# Altium project STM32F407_CORE.PrjPcb
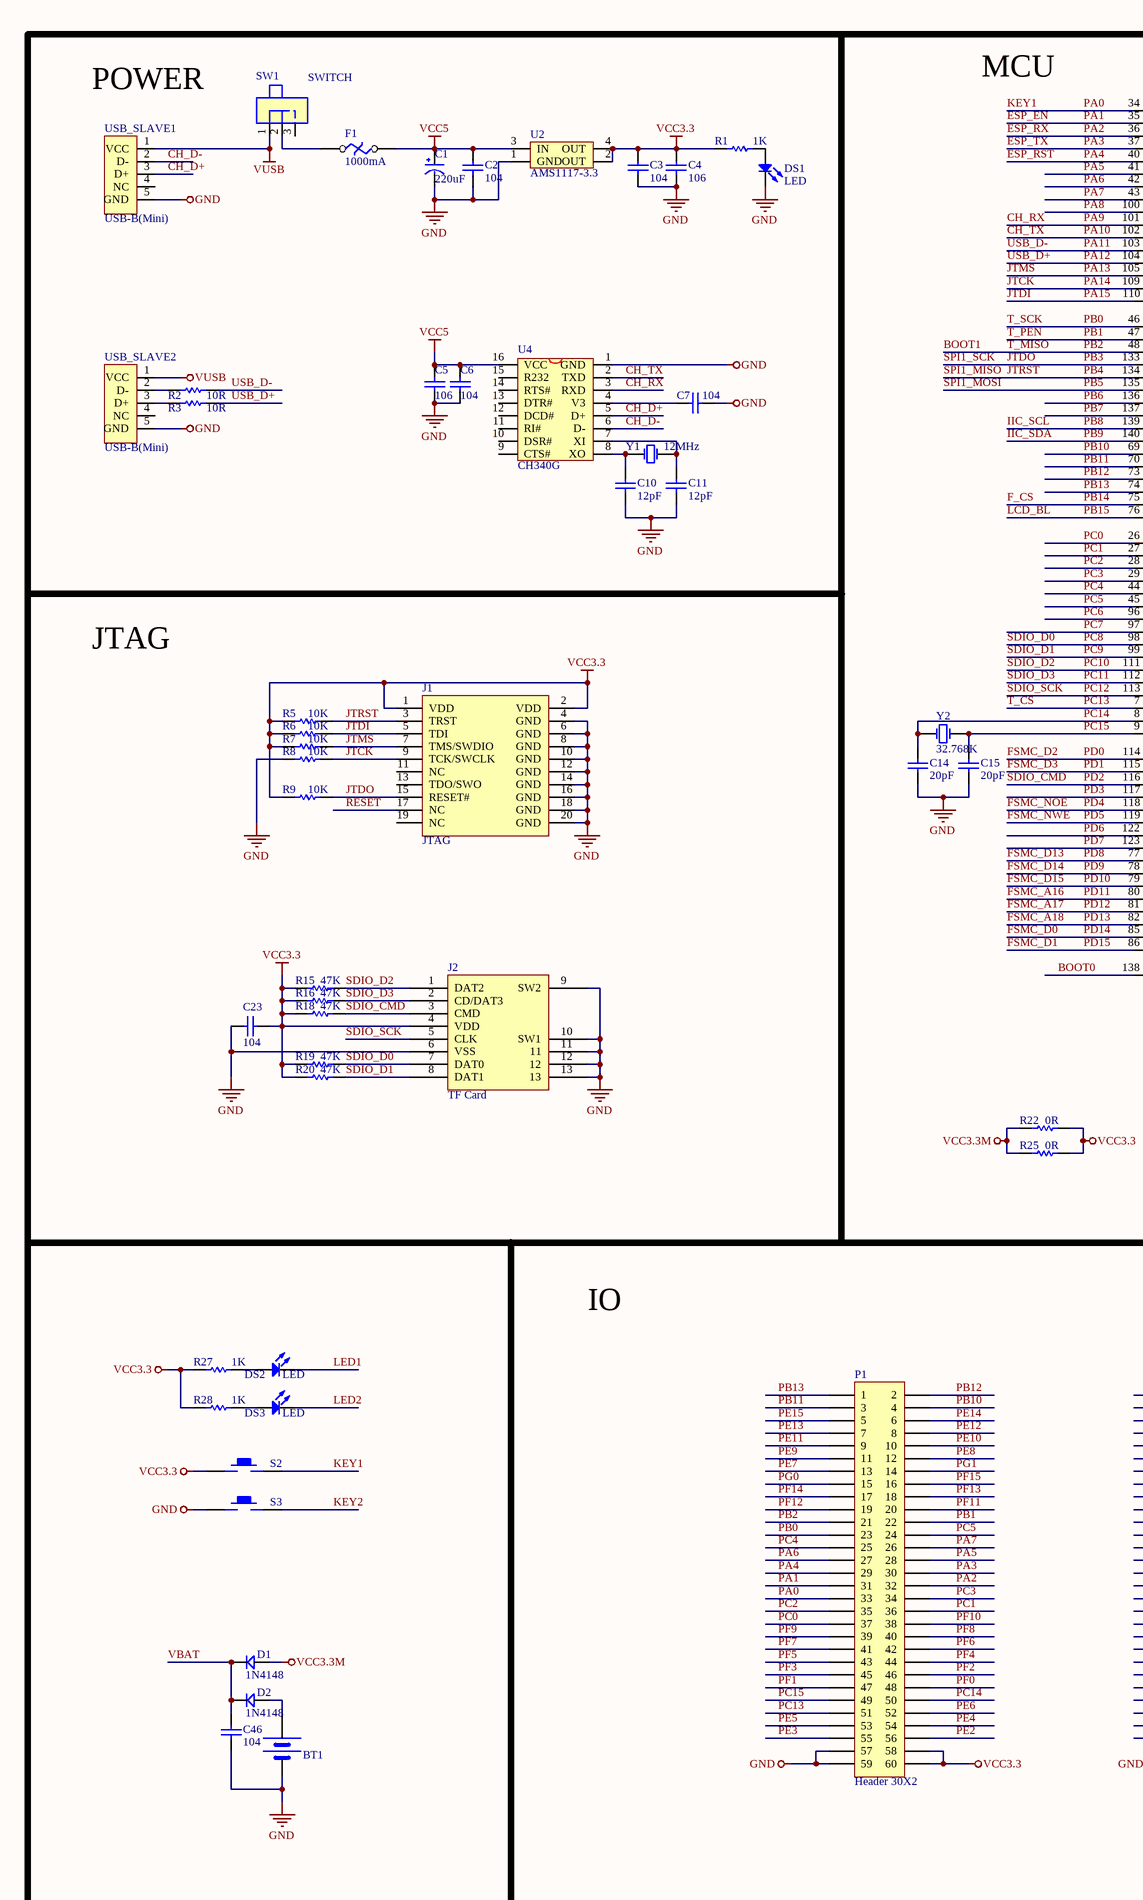
[diagram p0: STM32F407_CORE.SchDoc, left]
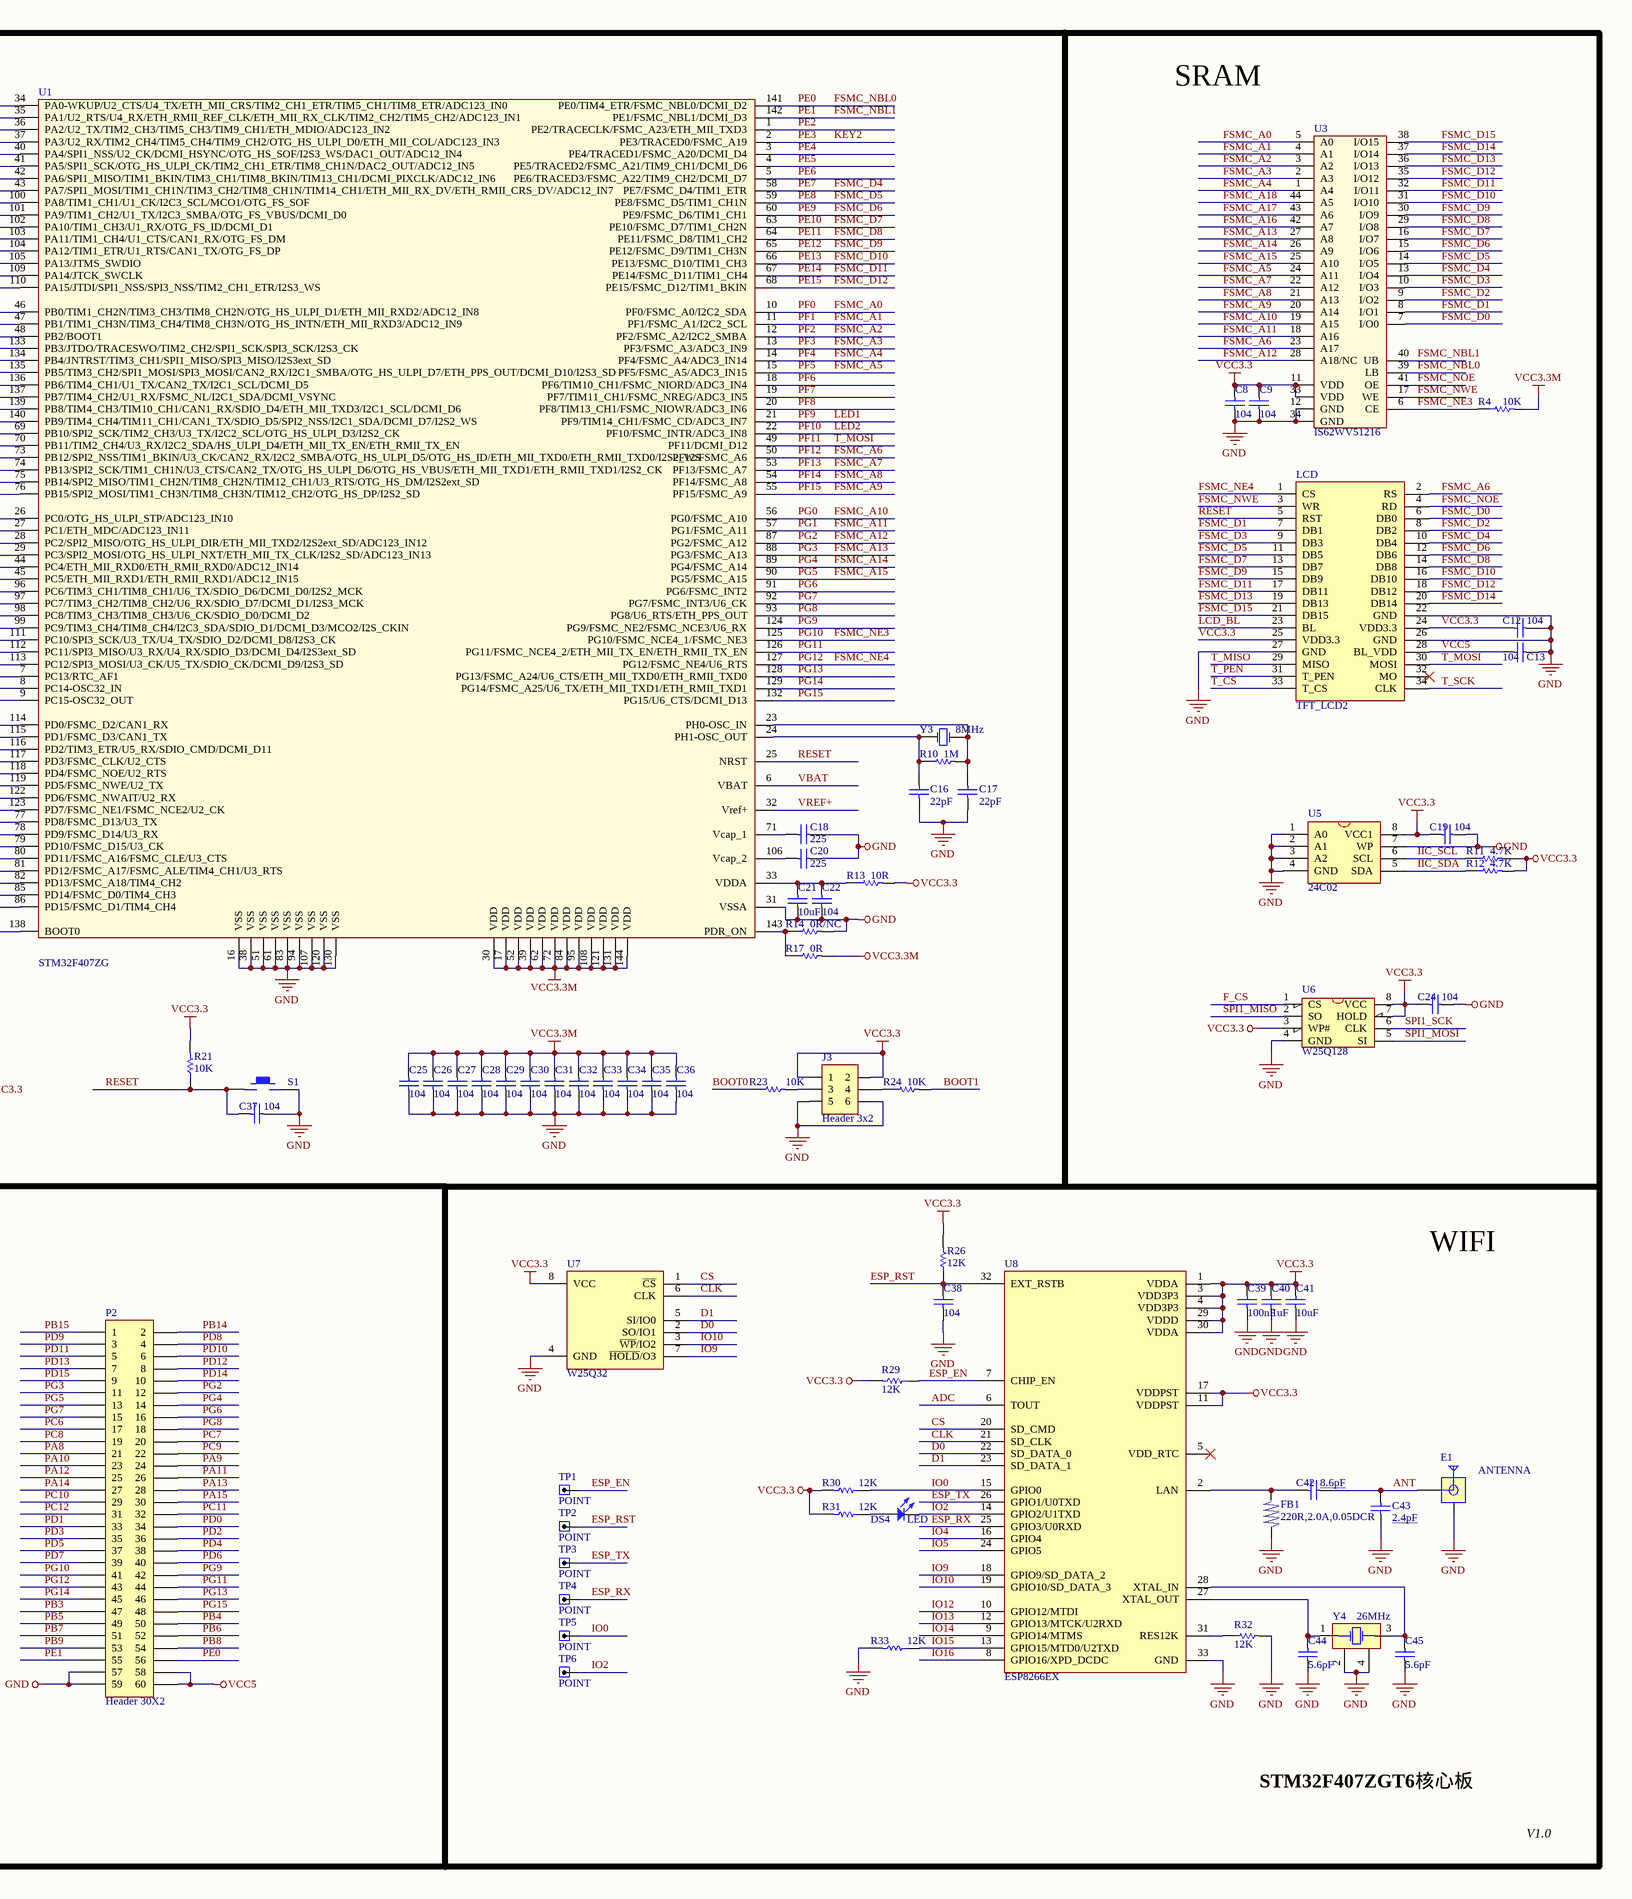
[diagram p1: STM32F407_CORE.SchDoc, right]
1 sheet, 119 parts. Net scope: global (net labels, ports and power ports of the same name join across sheets).
Board file: STM32F407_CORE.PcbDoc

## Sheet STM32F407_CORE.SchDoc
size A2

### Parts
BT1  BATTERY  [SBAT-1220]  (value not drawn)
C1  220uF  [TAJ-B]
C2  104  [C0603]
C3  104  [C0603]
C4  106  [C0603]
C5  106  [C0603]
C6  104  [C0603]
C7  104  [C0603]
C8  104  [C0603]
C9  104  [C0603]
C10  12pF  [C0603]
C11  12pF  [C0603]
C12  104  [C0603]
C13  104  [C0603]
C14  20pF  [C0603]
C15  20pF  [C0603]
C16  22pF  [C0603]
C17  22pF  [C0603]
C18  225  [C0603]
C19  104  [C0603]
C20  225  [C0603]
C21  10uF  [C0603]
C22  104  [C0603]
C23  104  [C0603]
C24  104  [C0603]
C25  104  [C0603]
C26  104  [C0603]
C27  104  [C0603]
C28  104  [C0603]
C29  104  [C0603]
C30  104  [C0603]
C31  104  [C0603]
C32  104  [C0603]
C33  104  [C0603]
C34  104  [C0603]
C35  104  [C0603]
C36  104  [C0603]
C37  104  [C0603]
C38  104  [C0603]
C39  100nF  [C0603]
C40  1uF  [C0603]
C41  10uF  [C0603]
C42  8.6pF  [C0603]
C43  2.4pF  [C0603]
C44  5.6pF  [C0603]
C45  5.6pF  [C0603]
C46  104  [C0603]
D1  1N4148  [D1206]
D2  1N4148  [D1206]
DS1  LED  [LED0603]
DS2  LED  [LED0603]
DS3  LED  [LED0603]
DS4  LED  [LED0603]
E1  ANTENNA  [ANT2.4G]
F1  1000mA  [F0805]
FB1  220R,2.0A,0.05DCR  [L0805]
J1  JTAG  [DC3-20P-W]
J2  TF Card  [TF-Card]
J3  Header 3x2  [HDR2X3]
LCD  TFT_LCD2  [TFT-HDR2X17]
P1  Header 30X2  [HDR2X30]
P2  Header 30X2  [HDR2X30]
R1  1K  [R0603]
R2  10R  [R0603]
R3  10R  [R0603]
R4  10K  [R0603]
R5  10K  [R0603]
R6  10K  [R0603]
R7  10K  [R0603]
R8  10K  [R0603]
R9  10K  [R0603]
R10  1M  [R0603]
R11  4.7K  [R0603]
R12  4.7K  [R0603]
R13  10R  [R0603]
R14  0R/NC  [R0603]
R15  47K  [R0603]
R16  47K  [R0603]
R17  0R  [R0603]
R18  47K  [R0603]
R19  47K  [R0603]
R20  47K  [R0603]
R21  10K  [R0603]
R22  0R  [R0603]
R23  10K  [R0603]
R24  10K  [R0603]
R25  0R  [R0603]
R26  12K  [R0603]
R27  1K  [R0603]
R28  1K  [R0603]
R29  12K  [R0603]
R30  12K  [R0603]
R31  12K  [R0603]
R32  12K  [R0603]
R33  12K  [R0603]
S1  KEY  [DSW-KFC-022S-H2.5]  (value not drawn)
S2  KEY  [DSW-KEY-SOT-4_5x4_5]  (value not drawn)
S3  KEY  [DSW-KEY-SOT-4_5x4_5]  (value not drawn)
SW1  SWITCH  [SW-SS12D07VG4]
TP1  POINT  [TP12]
TP2  POINT  [TP12]
TP3  POINT  [TP12]
TP4  POINT  [TP12]
TP5  POINT  [TP12]
TP6  POINT  [TP12]
U1  STM32F407ZG  [LQFP-144]
U2  AMS1117-3.3  [SOT-223]
U3  IS62WV51216  [TSOP-44]
U4  CH340G  [SOP-16M]
U5  24C02  [SOP-8]
U6  W25Q128  [SOIC-8]
U7  W25Q32  [SOIC-8]
U8  ESP8266EX  [QFN-32-1]
USB_SLAVE1  USB-B(Mini)  [USB-MicroUSB]
USB_SLAVE2  USB-B(Mini)  [USB-MicroUSB]
Y1  12MHz  [X-HC49-SMT]
Y2  32.768K  [X-MC146]
Y3  8MHz  [X-HC49-SMT]
Y4  26MHz  [X-TSX-3225]

### Nets
GND: BT1.2(GND) C1.2(GND) C2.1 C3.1 C4.1 C5.1 C6.1 C7.2 C8.2 C9.2 C10.2 C11.2 C12.2 C13.2 C14.2 C15.2 C16.2 C17.2 C18.1 C19.2 C20.1 C21.1 C22.1 C23.1 C24.2 C25.1 C26.1 C27.1 C28.1 C29.1 C30.1 C31.1 C32.1 C33.1 C34.1 C35.1 C36.1 C37.1 C38.1 C39.1 C40.1 C41.1 C43.2 C44.1 C45.1 C46.2 DS1.2(K) E1.2 FB1.2 J1.4(GND) J1.6(GND) J1.8(GND) J1.10(GND) J1.12(GND) J1.14(GND) J1.16(GND) J1.18(GND) J1.20(GND) J2.6(VSS) J2.9(SW2) J2.10(SW1) J2.11 J2.12 J2.13 J3.5 J3.6 LCD.22(GND) LCD.26(GND) LCD.27(GND) P1.57 P1.59 P2.57 P2.59 R8.1 R14.2 R32.2 R33.2 S1.2 S3.1 U1.16(VSS) U1.31(VSSA) U1.38(VSS) U1.51(VSS) U1.61(VSS) U1.83(VSS) U1.94(VSS) U1.107(VSS) U1.120(VSS) U1.130(VSS) U2.1(GND) U3.12(GND) U3.34(GND) U4.1(GND) U5.1(A0) U5.2(A1) U5.3(A2) U5.4(GND) U5.7(WP) U6.4(GND) U7.4(GND) U8.33(GND) USB_SLAVE1.5(GND) USB_SLAVE2.5(GND) Y4.2 Y4.4
VCC3.3: C3.2 C4.2 C8.1 C9.1 C12.1 C19.1 C23.2 C24.1 C39.2 C40.2 C41.2 J1.1(VDD) J1.2(VDD) J2.4(VDD) J3.1 J3.2 LCD.24(VDD3.3) LCD.25(VDD3.3) P1.58 P1.60 R1.1 R5.1 R6.1 R7.1 R9.1 R11.2 R12.2 R13.2 R15.1 R16.1 R18.1 R19.1 R20.1 R21.2 R22.2 R25.2 R26.2 R27.1 R28.1 R29.2 R30.2 R31.2 S2.1 U2.2(OUT) U2.4(OUT) U3.11(VDD) U3.33(VDD) U5.8(VCC1) U6.3(WP#) U6.7(HOLD) U6.8(VCC) U7.8(VCC) U8.1(VDDA) U8.3(VDD3P3) U8.4(VDD3P3) U8.11(VDDPST) U8.17(VDDPST) U8.29(VDDD) U8.30(VDDA)
VCC3.3M: C25.2 C26.2 C27.2 C28.2 C29.2 C30.2 C31.2 C32.2 C33.2 C34.2 C35.2 C36.2 D1.1 R4.2 R17.2 R22.1 R25.1 U1.17(VDD) U1.30(VDD) U1.39(VDD) U1.52(VDD) U1.62(VDD) U1.72(VDD) U1.84(VDD) U1.95(VDD) U1.108(VDD) U1.121(VDD) U1.131(VDD) U1.144(VDD)
VCC5: C1.1(VCC) C2.2 C5.2 C6.2 C13.1 F1.2 LCD.28(BL_VDD) P2.58 P2.60 U2.3(IN) U4.16(VCC)
VUSB: SW1.1 USB_SLAVE1.1(VCC) USB_SLAVE2.1(VCC)
ADC: U8.6(TOUT)
ANT: C42.1 C43.1 E1.1
BOOT0: R23.1 U1.138(BOOT0)
BOOT1: LCD.29(MISO) P1.21 R24.2 U1.48(PB2/BOOT1)  [also labelled PB2, T_MISO]
CH_D+: U4.5(D+) USB_SLAVE1.3(D+)
CH_D-: U4.6(D-) USB_SLAVE1.2(D-)
CH_RX: P2.24 U1.101(PA9/TIM1_CH2/U1_TX/I2C3_SMBA/OTG_FS_VBUS/DCMI_D0) U4.3(RXD)  [also labelled PA9]
CH_TX: P2.23 U1.102(PA10/TIM1_CH3/U1_RX/OTG_FS_ID/DCMI_D1) U4.2(TXD)  [also labelled PA10]
CLK: U7.6(CLK) U8.21(SD_CLK)
CS: U7.1(~{CS}) U8.20(SD_CMD)
D0: U7.2(SO/IO1) U8.22(SD_DATA_0)
D1: U7.5(SI/IO0) U8.23(SD_DATA_1)
ESP_EN: P1.31 R29.1 TP1.1 U1.35(PA1/U2_RTS/U4_RX/ETH_RMII_REF_CLK/ETH_MII_RX_CLK/TIM2_CH2/TIM5_CH2/ADC123_IN1) U8.7(CHIP_EN)  [also labelled PA1]
ESP_RST: C38.2 P1.29 R26.1 TP2.1 U1.40(PA4/SPI1_NSS/U2_CK/DCMI_HSYNC/OTG_HS_SOF/I2S3_WS/DAC1_OUT/ADC12_IN4) U8.32(EXT_RSTB)  [also labelled PA4]
ESP_RX: P1.32 TP4.1 U1.36(PA2/U2_TX/TIM2_CH3/TIM5_CH3/TIM9_CH1/ETH_MDIO/ADC123_IN2) U8.25(GPIO3/U0RXD)  [also labelled PA2]
ESP_TX: P1.30 TP3.1 U1.37(PA3/U2_RX/TIM2_CH4/TIM5_CH4/TIM9_CH2/OTG_HS_ULPI_D0/ETH_MII_COL/ADC123_IN3) U8.26(GPIO1/U0TXD)  [also labelled PA3]
F_CS: P2.2 U1.75(PB14/SPI2_MISO/TIM1_CH2N/TIM8_CH2N/TIM12_CH1/U3_RTS/OTG_HS_DM/I2S2ext_SD) U6.1(CS)  [also labelled PB14]
FSMC_A0: P1.48 U1.10(PF0/FSMC_A0/I2C2_SDA) U3.5(A0)  [also labelled PF0]
FSMC_A1: P1.47 U1.11(PF1/FSMC_A1/I2C2_SCL) U3.4(A1)  [also labelled PF1]
FSMC_A2: P1.46 U1.12(PF2/FSMC_A2/I2C2_SMBA) U3.3(A2)  [also labelled PF2]
FSMC_A3: P1.45 U1.13(PF3/FSMC_A3/ADC3_IN9) U3.2(A3)  [also labelled PF3]
FSMC_A4: P1.44 U1.14(PF4/FSMC_A4/ADC3_IN14) U3.1(A4)  [also labelled PF4]
FSMC_A5: P1.43 U1.15(PF5/FSMC_A5/ADC3_IN15) U3.24(A11)  [also labelled PF5]
FSMC_A6: LCD.2(RS) P1.19 U1.50(PF12/FSMC_A6) U3.23(A17)  [also labelled PF12]
FSMC_A7: P1.18 U1.53(PF13/FSMC_A7) U3.22(A12)  [also labelled PF13]
FSMC_A8: P1.17 U1.54(PF14/FSMC_A8) U3.21(A13)  [also labelled PF14]
FSMC_A9: P1.16 U1.55(PF15/FSMC_A9) U3.20(A14)  [also labelled PF15]
FSMC_A10: P1.15 U1.56(PG0/FSMC_A10) U3.19(A15)  [also labelled PG0]
FSMC_A11: P1.14 U1.57(PG1/FSMC_A11) U3.18(A16)  [also labelled PG1]
FSMC_A12: P2.12 U1.87(PG2/FSMC_A12) U3.28(A18/NC)  [also labelled PG2]
FSMC_A13: P2.11 U1.88(PG3/FSMC_A13) U3.27(A8)  [also labelled PG3]
FSMC_A14: P2.14 U1.89(PG4/FSMC_A14) U3.26(A9)  [also labelled PG4]
FSMC_A15: P2.13 U1.90(PG5/FSMC_A15) U3.25(A10)  [also labelled PG5]
FSMC_A16: P2.5 U1.80(PD11/FSMC_A16/FSMC_CLE/U3_CTS) U3.42(A7)  [also labelled PD11]
FSMC_A17: P2.8 U1.81(PD12/FSMC_A17/FSMC_ALE/TIM4_CH1/U3_RTS) U3.43(A6)  [also labelled PD12]
FSMC_A18: P2.7 U1.82(PD13/FSMC_A18/TIM4_CH2) U3.44(A5)  [also labelled PD13]
FSMC_D0: LCD.6(DB0) P2.10 U1.85(PD14/FSMC_D0/TIM4_CH3) U3.7(I/O0)  [also labelled PD14]
FSMC_D1: LCD.7(DB1) P2.9 U1.86(PD15/FSMC_D1/TIM4_CH4) U3.8(I/O1)  [also labelled PD15]
FSMC_D2: LCD.8(DB2) P2.34 U1.114(PD0/FSMC_D2/CAN1_RX) U3.9(I/O2)  [also labelled PD0]
FSMC_D3: LCD.9(DB3) P2.33 U1.115(PD1/FSMC_D3/CAN1_TX) U3.10(I/O3)  [also labelled PD1]
FSMC_D4: LCD.10(DB4) P1.13 U1.58(PE7/FSMC_D4/TIM1_ETR) U3.13(I/O4)  [also labelled PE7]
FSMC_D5: LCD.11(DB5) P1.12 U1.59(PE8/FSMC_D5/TIM1_CH1N) U3.14(I/O5)  [also labelled PE8]
FSMC_D6: LCD.12(DB6) P1.11 U1.60(PE9/FSMC_D6/TIM1_CH1) U3.15(I/O6)  [also labelled PE9]
FSMC_D7: LCD.13(DB7) P1.10 U1.63(PE10/FSMC_D7/TIM1_CH2N) U3.16(I/O7)  [also labelled PE10]
FSMC_D8: LCD.14(DB8) P1.9 U1.64(PE11/FSMC_D8/TIM1_CH2) U3.29(I/O8)  [also labelled PE11]
FSMC_D9: LCD.15(DB9) P1.8 U1.65(PE12/FSMC_D9/TIM1_CH3N) U3.30(I/O9)  [also labelled PE12]
FSMC_D10: LCD.16(DB10) P1.7 U1.66(PE13/FSMC_D10/TIM1_CH3) U3.31(I/O10)  [also labelled PE13]
FSMC_D11: LCD.17(DB11) P1.6 U1.67(PE14/FSMC_D11/TIM1_CH4) U3.32(I/O11)  [also labelled PE14]
FSMC_D12: LCD.18(DB12) P1.5 U1.68(PE15/FSMC_D12/TIM1_BKIN) U3.35(I/O12)  [also labelled PE15]
FSMC_D13: LCD.19(DB13) P2.4 U1.77(PD8/FSMC_D13/U3_TX) U3.36(I/O13)  [also labelled PD8]
FSMC_D14: LCD.20(DB14) P2.3 U1.78(PD9/FSMC_D14/U3_RX) U3.37(I/O14)  [also labelled PD9]
FSMC_D15: LCD.21(DB15) P2.6 U1.79(PD10/FSMC_D15/U3_CK) U3.38(I/O15)  [also labelled PD10]
FSMC_NBL0: P2.56 U1.141(PE0/TIM4_ETR/FSMC_NBL0/DCMI_D2) U3.39(LB)  [also labelled PE0]
FSMC_NBL1: P2.55 U1.142(PE1/FSMC_NBL1/DCMI_D3) U3.40(UB)  [also labelled PE1]
FSMC_NE3: P2.41 R4.1 U1.125(PG10/FSMC_NCE4_1/FSMC_NE3) U3.6(CE)  [also labelled PG10]
FSMC_NE4: LCD.1(CS) P2.43 U1.127(PG12/FSMC_NE4/U6_RTS)  [also labelled PG12]
FSMC_NOE: LCD.4(RD) P2.38 U1.118(PD4/FSMC_NOE/U2_RTS) U3.41(OE)  [also labelled PD4]
FSMC_NWE: LCD.3(WR) P2.37 U1.119(PD5/FSMC_NWE/U2_TX) U3.17(WE)  [also labelled PD5]
IIC_SCL: P2.54 R11.1 U1.139(PB8/TIM4_CH3/TIM10_CH1/CAN1_RX/SDIO_D4/ETH_MII_TXD3/I2C1_SCL/DCMI_D6) U5.6(SCL)  [also labelled PB8]
IIC_SDA: P2.53 R12.1 U1.140(PB9/TIM4_CH4/TIM11_CH1/CAN1_TX/SDIO_D5/SPI2_NSS/I2C1_SDA/DCMI_D7/I2S2_WS) U5.5(SDA)  [also labelled PB9]
IO0: R30.1 TP5.1 U8.15(GPIO0)
IO2: DS4.2(K) TP6.1 U8.14(GPIO2/U1TXD)
IO4: U8.16(GPIO4)
IO5: U8.24(GPIO5)
IO9: U7.7(~{HOLD}/O3) U8.18(GPIO9/SD_DATA_2)
IO10: U7.3(~{WP}/IO2) U8.19(GPIO10/SD_DATA_3)
IO12: U8.10(GPIO12/MTDI)
IO13: U8.12(GPIO13/MTCK/U2RXD)
IO14: U8.9(GPIO14/MTMS)
IO15: R33.1 U8.13(GPIO15/MTD0/U2TXD)
IO16: U8.8(GPIO16/XPD_DCDC)
JTCK: J1.9(TCK/SWCLK) P2.27 R8.2 U1.109(PA14/JTCK_SWCLK)  [also labelled PA14]
JTDI: J1.5(TDI) P2.30 R6.2 U1.110(PA15/JTDI/SPI1_NSS/SPI3_NSS/TIM2_CH1_ETR/I2S3_WS)  [also labelled PA15]
JTDO: J1.15(RESET#) P2.47 R9.2 U1.133(PB3/JTDO/TRACESWO/TIM2_CH2/SPI1_SCK/SPI3_SCK/I2S3_CK) U6.6(CLK)  [also labelled PB3, SPI1_SCK]
JTMS: J1.7(TMS/SWDIO) P2.28 R7.2 U1.105(PA13/JTMS_SWDIO)  [also labelled PA13]
JTRST: J1.3(TRST) P2.50 R5.2 U1.134(PB4/JNTRST/TIM3_CH1/SPI1_MISO/SPI3_MISO/I2S3ext_SD) U6.2(SO)  [also labelled PB4, SPI1_MISO]
KEY1: P1.33 S2.2 U1.34(PA0-WKUP/U2_CTS/U4_TX/ETH_MII_CRS/TIM2_CH1_ETR/TIM5_CH1/TIM8_ETR/ADC123_IN0)  [also labelled PA0]
KEY2: P1.55 S3.2 U1.2(PE3/TRACED0/FSMC_A19)  [also labelled PE3]
LCD_BL: LCD.23(BL) P2.1 U1.76(PB15/SPI2_MOSI/TIM1_CH3N/TIM8_CH3N/TIM12_CH2/OTG_HS_DP/I2S2_SD)  [also labelled PB15]
LED1: DS2.2(K) P1.39 U1.21(PF9/TIM14_CH1/FSMC_CD/ADC3_IN7)  [also labelled PF9]
LED2: DS3.2(K) P1.38 U1.22(PF10/FSMC_INTR/ADC3_IN8)  [also labelled PF10]
PA5: P1.28 U1.41(PA5/SPI1_SCK/OTG_HS_ULPI_CK/TIM2_CH1_ETR/TIM8_CH1N/DAC2_OUT/ADC12_IN5)
PA6: P1.27 U1.42(PA6/SPI1_MISO/TIM1_BKIN/TIM3_CH1/TIM8_BKIN/TIM13_CH1/DCMI_PIXCLK/ADC12_IN6)
PA7: P1.26 U1.43(PA7/SPI1_MOSI/TIM1_CH1N/TIM3_CH2/TIM8_CH1N/TIM14_CH1/ETH_MII_RX_DV/ETH_RMII_CRS_DV/ADC12_IN7)
PA8: P2.21 U1.100(PA8/TIM1_CH1/U1_CK/I2C3_SCL/MCO1/OTG_FS_SOF)
PA11: P2.26 R2.2 U1.103(PA11/TIM1_CH4/U1_CTS/CAN1_RX/OTG_FS_DM)  [also labelled USB_D-]
PA12: P2.25 R3.2 U1.104(PA12/TIM1_ETR/U1_RTS/CAN1_TX/OTG_FS_DP)  [also labelled USB_D+]
PB0: LCD.34(CLK) P1.23 U1.46(PB0/TIM1_CH2N/TIM3_CH3/TIM8_CH2N/OTG_HS_ULPI_D1/ETH_MII_RXD2/ADC12_IN8)  [also labelled T_SCK]
PB1: LCD.31(T_PEN) P1.22 U1.47(PB1/TIM1_CH3N/TIM3_CH4/TIM8_CH3N/OTG_HS_INTN/ETH_MII_RXD3/ADC12_IN9)  [also labelled T_PEN]
PB5: P2.49 U1.135(PB5/TIM3_CH2/SPI1_MOSI/SPI3_MOSI/CAN2_RX/I2C1_SMBA/OTG_HS_ULPI_D7/ETH_PPS_OUT/DCMI_D10/I2S3_SD) U6.5(SI)  [also labelled SPI1_MOSI]
PB6: P2.52 U1.136(PB6/TIM4_CH1/U1_TX/CAN2_TX/I2C1_SCL/DCMI_D5)
PB7: P2.51 U1.137(PB7/TIM4_CH2/U1_RX/FSMC_NL/I2C1_SDA/DCMI_VSYNC)
PB10: P1.4 U1.69(PB10/SPI2_SCK/TIM2_CH3/U3_TX/I2C2_SCL/OTG_HS_ULPI_D3/I2S2_CK)
PB11: P1.3 U1.70(PB11/TIM2_CH4/U3_RX/I2C2_SDA/HS_ULPI_D4/ETH_MII_TX_EN/ETH_RMII_TX_EN)
PB12: P1.2 U1.73(PB12/SPI2_NSS/TIM1_BKIN/U3_CK/CAN2_RX/I2C2_SMBA/OTG_HS_ULPI_D5/OTG_HS_ID/ETH_MII_TXD0/ETH_RMII_TXD0/I2S2_WS)
PB13: P1.1 U1.74(PB13/SPI2_SCK/TIM1_CH1N/U3_CTS/CAN2_TX/OTG_HS_ULPI_D6/OTG_HS_VBUS/ETH_MII_TXD1/ETH_RMII_TXD1/I2S2_CK)
PC0: P1.37 U1.26(PC0/OTG_HS_ULPI_STP/ADC123_IN10)
PC1: P1.36 U1.27(PC1/ETH_MDC/ADC123_IN11)
PC2: P1.35 U1.28(PC2/SPI2_MISO/OTG_HS_ULPI_DIR/ETH_MII_TXD2/I2S2ext_SD/ADC123_IN12)
PC3: P1.34 U1.29(PC3/SPI2_MOSI/OTG_HS_ULPI_NXT/ETH_MII_TX_CLK/I2S2_SD/ADC123_IN13)
PC4: P1.25 U1.44(PC4/ETH_MII_RXD0/ETH_RMII_RXD0/ADC12_IN14)
PC5: P1.24 U1.45(PC5/ETH_MII_RXD1/ETH_RMII_RXD1/ADC12_IN15)
PC6: P2.17 U1.96(PC6/TIM3_CH1/TIM8_CH1/U6_TX/SDIO_D6/DCMI_D0/I2S2_MCK)
PC7: P2.20 U1.97(PC7/TIM3_CH2/TIM8_CH2/U6_RX/SDIO_D7/DCMI_D1/I2S3_MCK)
PC8: J2.7(DAT0) P2.19 R19.2 U1.98(PC8/TIM3_CH3/TIM8_CH3/U6_CK/SDIO_D0/DCMI_D2)  [also labelled SDIO_D0]
PC9: J2.8(DAT1) P2.22 R20.2 U1.99(PC9/TIM3_CH4/TIM8_CH4/I2C3_SDA/SDIO_D1/DCMI_D3/MCO2/I2S_CKIN)  [also labelled SDIO_D1]
PC10: J2.1(DAT2) P2.29 R15.2 U1.111(PC10/SPI3_SCK/U3_TX/U4_TX/SDIO_D2/DCMI_D8/I2S3_CK)  [also labelled SDIO_D2]
PC11: J2.2(CD/DAT3) P2.32 R16.2 U1.112(PC11/SPI3_MISO/U3_RX/U4_RX/SDIO_D3/DCMI_D4/I2S3ext_SD)  [also labelled SDIO_D3]
PC12: J2.5(CLK) P2.31 U1.113(PC12/SPI3_MOSI/U3_CK/U5_TX/SDIO_CK/DCMI_D9/I2S3_SD)  [also labelled SDIO_SCK]
PC13: LCD.33(T_CS) P1.51 U1.7(PC13/RTC_AF1)  [also labelled T_CS]
PC14: C14.1 P1.50 U1.8(PC14-OSC32_IN) Y2.2(OSC2)
PC15: C15.1 P1.49 U1.9(PC15-OSC32_OUT) Y2.1(OSC1)
PD2: J2.3(CMD) P2.36 R18.2 U1.116(PD2/TIM3_ETR/U5_RX/SDIO_CMD/DCMI_D11)  [also labelled SDIO_CMD]
PD3: P2.35 U1.117(PD3/FSMC_CLK/U2_CTS)
PD6: P2.40 U1.122(PD6/FSMC_NWAIT/U2_RX)
PD7: P2.39 U1.123(PD7/FSMC_NE1/FSMC_NCE2/U2_CK)
PE2: P1.56 U1.1(PE2/TRACECLK/FSMC_A23/ETH_MII_TXD3)
PE4: P1.54 U1.3(PE4/TRACED1/FSMC_A20/DCMI_D4)
PE5: P1.53 U1.4(PE5/TRACED2/FSMC_A21/TIM9_CH1/DCMI_D6)
PE6: P1.52 U1.5(PE6/TRACED3/FSMC_A22/TIM9_CH2/DCMI_D7)
PF6: P1.42 U1.18(PF6/TIM10_CH1/FSMC_NIORD/ADC3_IN4)
PF7: P1.41 U1.19(PF7/TIM11_CH1/FSMC_NREG/ADC3_IN5)
PF8: P1.40 U1.20(PF8/TIM13_CH1/FSMC_NIOWR/ADC3_IN6)
PF11: LCD.30(MOSI) P1.20 U1.49(PF11/DCMI_D12)  [also labelled T_MOSI]
PG6: P2.16 U1.91(PG6/FSMC_INT2)
PG7: P2.15 U1.92(PG7/FSMC_INT3/U6_CK)
PG8: P2.18 U1.93(PG8/U6_RTS/ETH_PPS_OUT)
PG9: P2.42 U1.124(PG9/FSMC_NE2/FSMC_NCE3/U6_RX)
PG11: P2.44 U1.126(PG11/FSMC_NCE4_2/ETH_MII_TX_EN/ETH_RMII_TX_EN)
PG13: P2.46 U1.128(PG13/FSMC_A24/U6_CTS/ETH_MII_TXD0/ETH_RMII_TXD0)
PG14: P2.45 U1.129(PG14/FSMC_A25/U6_TX/ETH_MII_TXD1/ETH_RMII_TXD1)
PG15: P2.48 U1.132(PG15/U6_CTS/DCMI_D13)
RESET: C37.2 J1.17(NC) LCD.5(RST) R21.1 S1.1 U1.25(NRST)
VBAT: C46.1 D1.2 D2.2 U1.6(VBAT)
VREF+: U1.32(Vref+)
NetBT1_1: BT1.1(VCC) D2.1
NetC7_1: C7.1 U4.4(V3)
NetC10_1: C10.1 U4.8(XO) Y1.1(OSC1)
NetC11_1: C11.1 U4.7(XI) Y1.2(OSC2)
NetC16_1: C16.1 R10.1 U1.24(PH1-OSC_OUT) Y3.1(OSC1)
NetC17_1: C17.1 R10.2 U1.23(PH0-OSC_IN) Y3.2(OSC2)
NetC18_2: C18.2 U1.71(Vcap_1)
NetC20_2: C20.2 U1.106(Vcap_2)
NetC21_2: C21.2 C22.2 R13.1 U1.33(VDDA)
NetC42_2: C42.2 FB1.1 U8.2(LAN)
NetC44_2: C44.2 U8.27(XTAL_OUT) Y4.1
NetC45_2: C45.2 U8.28(XTAL_IN) Y4.3
NetDS1_1: DS1.1(A) R1.2
NetDS2_1: DS2.1(A) R27.2
NetDS3_1: DS3.1(A) R28.2
NetDS4_1: DS4.1(A) R31.1
NetF1_1: F1.1 SW1.2
NetJ3_3: J3.3 R23.2
NetJ3_4: J3.4 R24.1
NetR2_1: R2.1 USB_SLAVE2.2(D-)
NetR3_1: R3.1 USB_SLAVE2.3(D+)
NetR14_1: R14.1 R17.1 U1.143(PDR_ON)
NetR32_1: R32.1 U8.31(RES12K)

Not connected (* = marked no-connect by the designer): J1 11(NC) 13(TDO/SWO) 19(NC); LCD 32(MO)*; SW1 3; U4 9(CTS#) 10(DSR#) 11(RI#) 12(DCD#) 13(DTR#) 14(RTS#) 15(R232); U8 5(VDD_RTC)*; USB_SLAVE1 4(NC); USB_SLAVE2 4(NC)

### Notes on the sheet
- POWER
- MCU
- SRAM
- JTAG
- IO
- WIFI
- STM32F407ZGT6核心板
- V1.0

### Library data of the parts
BT1 = BATTERY: 电池座
C1 = C Pol: 极性电容
C2-C46 = C: 电容; Published: 8-Jun-2000; LatestRevisionDate: 17-Jul-2002; LatestRevisionNote: Re-released for DXP Platform.; PackageReference: RAD-0.3; Publisher: Altium Limited; PackageDescription: Radial Cap, Thru-Hole; 2 Leads; 0.3 in Pin Spacing
D1 D2 = D: 通用二极管
DS1-DS4 = LED: Typical RED, GREEN, YELLOW, AMBER GaAs LED; Published: 8-Jun-2000; LatestRevisionDate: 17-Jul-2002; LatestRevisionNote: Re-released for DXP Platform.; PackageDocument: Feb-2002; PackageReference: 3.2X1.6X1.1; Publisher: Altium Limited
F1 = F: 熔断开关
FB1 = L-Beads: 磁珠
J3 = Header 3x2: Header, 6-Pin; LatestRevisionDate: 17-Jul-2002; LatestRevisionNote: Re-released for DXP Platform.; Publisher: Altium Limited
P1 P2 = Header 30X2: Header, 60-Pin, Dual row; LatestRevisionDate: 17-Jul-2002; LatestRevisionNote: Re-released for DXP Platform.; Publisher: Altium Limited
R1-R33 = RES0603: 电阻; Published: 8-Jun-2000; LatestRevisionDate: 17-Jul-2002; LatestRevisionNote: Re-released for DXP Platform.; PackageReference: AXIAL-0.3; Publisher: Altium Limited; PackageDescription: Axial Device, Thru-Hole; 2 Leads; 0.3 in Pin Spacing
S1-S3 = KEY: 普通轻触按钮
U2 = AMS1117: 电源转换5Vto3.3V
U3 = IS61LV51216
U4 = CH340G: USB2UART
U5 = 24C256
U6 = W25X16: W25X16;SST25VF016;MX25L1605
USB_SLAVE1 USB_SLAVE2 = USB5
Y1-Y3 = XTAL: Crystal Oscillator; Published: 8-Jun-2000; LatestRevisionDate: 17-Jul-2002; LatestRevisionNote: Re-released for DXP Platform.; Publisher: Altium Limited
Y4 = XTAL_1: Crystal Oscillator; Published: 8-Jun-2000; LatestRevisionDate: 17-Jul-2002; LatestRevisionNote: Re-released for DXP Platform.; Publisher: Altium Limited